# EAGLE schematic s3-pilot2 (EAGLE 7.2.0)
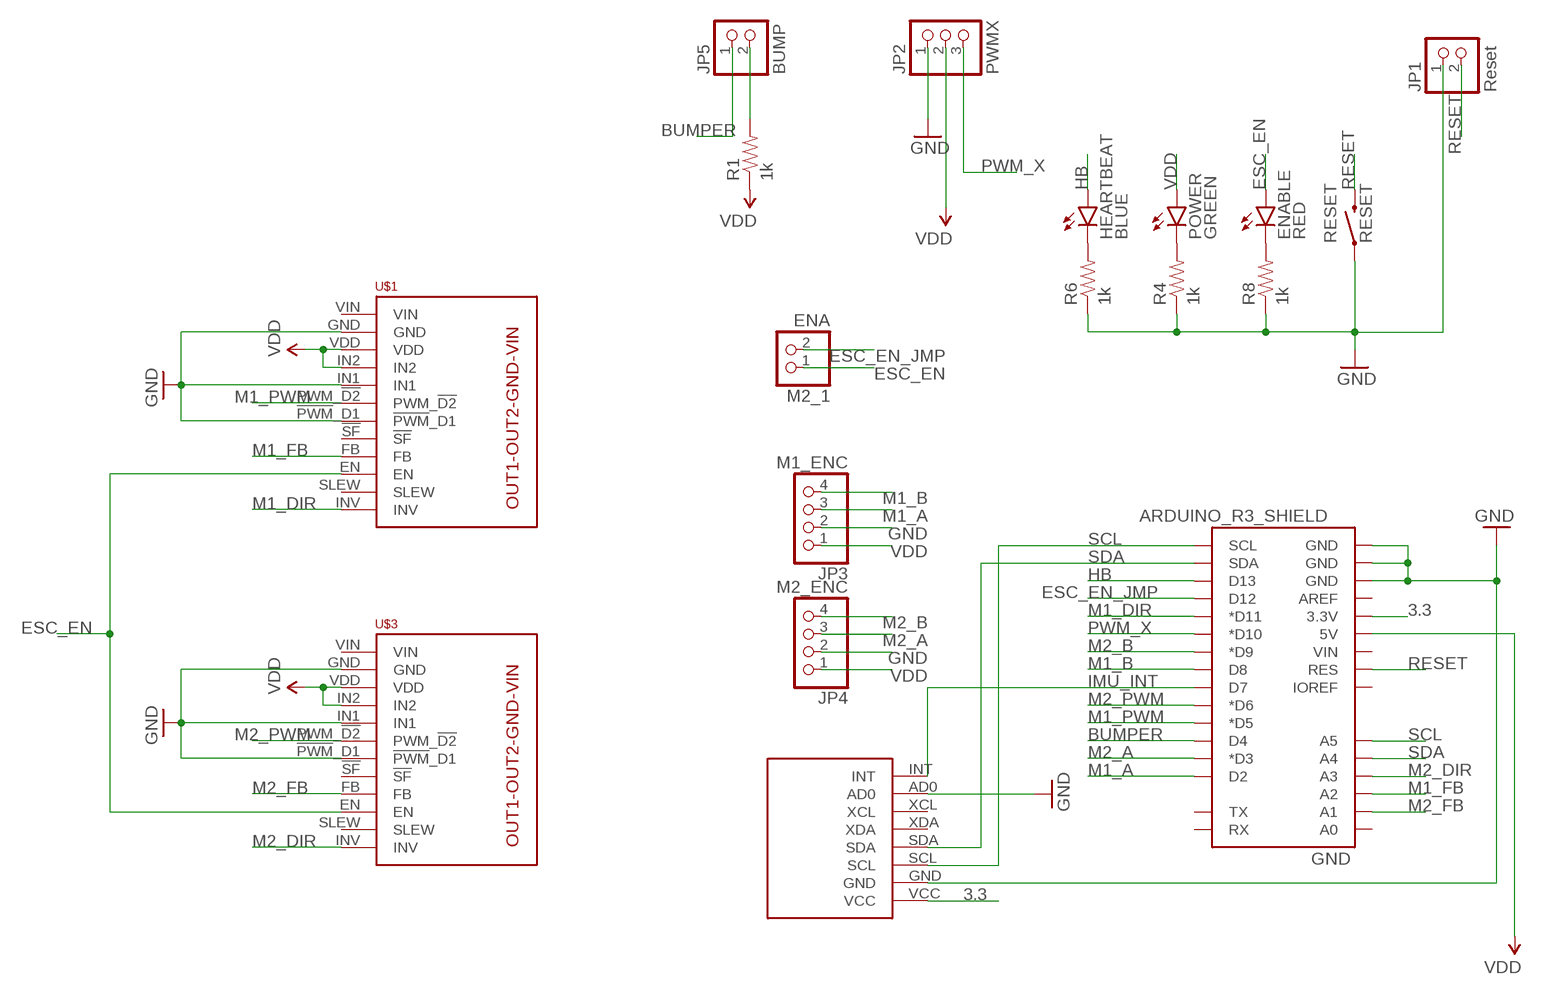
[diagram p0: schematic, sheet 1]

## Parts
ENABLE  RED  LED-RED1206  [LED-1206]
GND  ARDUINO_R3_SHIELD  [UNO_R3_SHIELD]
HEARTBEAT  BLUE  LED-BLUE1206  [LED-1206]
JP1  Reset  PINHD-1X2  [1X02]
JP2  PWMX  PINHD-1X3/90  [1X03/90]
JP3  M1_ENC  PINHD-1X4/90  [1X04/90]
JP4  M2_ENC  PINHD-1X4/90  [1X04/90]
JP5  BUMP  PINHD-1X2/90  [1X02/90]
M2_1  ENA  PINHD-1X2  [1X02]
MPU6050  MPU-6050-BO  [MPU-6050-BO]
POWER  GREEN  LED-GREENLARGE  [LED-1206]
R1  1k  RESISTOR1206  [1206]
R4  1k  RESISTOR1206  [1206]
R6  1k  RESISTOR1206  [1206]
R8  1k  RESISTOR1206  [1206]
RESET  RESET  SWITCH-MOMENTARY-2SMD-4  [TACTILE_SWITCH_TALL]
U$1  M1  MC33926-SINGLE-BO  [MC33926-SINGLE-BO]
U$3  M2  MC33926-SINGLE-BO  [MC33926-SINGLE-BO]

## Nets
3.3: GND.3.3V MPU6050.VCC
BUMPER: GND.D4 JP5.1
ESC_EN: ENABLE.A M2_1.1 U$1.EN U$3.EN
ESC_EN_JMP: GND.D12 M2_1.2
GND [Supply]: GND.GND@0(GND) GND.GND@1(GND) GND.GND@2(GND) JP1.1 JP2.1 JP3.2 JP4.2 MPU6050.AD0 MPU6050.GND R4.1 R6.1 R8.1 RESET.A2 U$1.!PWM!_D1 U$1.GND U$1.IN1 U$3.!PWM!_D1 U$3.GND U$3.IN1
HB: GND.D13 HEARTBEAT.A
IMU_INT: GND.D7 MPU6050.INT
M1_A: GND.D2 JP3.3
M1_B: GND.D8 JP3.4
M1_DIR: GND.D11(*D11) U$1.INV
M1_FB: GND.A2 U$1.FB
M1_PWM: GND.D5(*D5) U$1.PWM_!D2
M2_A: GND.D3(*D3) JP4.3
M2_B: GND.D9(*D9) JP4.4
M2_DIR: GND.A3 U$3.INV
M2_FB: GND.A1 U$3.FB
M2_PWM: GND.D6(*D6) U$3.PWM_!D2
N$3: JP5.2 R1.2
N$21: POWER.C R4.2
N$23: ENABLE.C R8.2
N$24: HEARTBEAT.C R6.2
PWM_X: GND.D10(*D10) JP2.3
RESET: GND.RES JP1.2 RESET.B2
SCL: GND.A5 GND.SCL MPU6050.SCL
SDA: GND.A4 GND.SDA MPU6050.SDA
VDD [Supply]: GND.5V JP2.2 JP3.1 JP4.1 POWER.A R1.1 U$1.IN2 U$1.VDD U$3.IN2 U$3.VDD
Unconnected: GND.A0 GND.AREF GND.IOREF GND.RX GND.TX GND.VIN MPU6050.XCL MPU6050.XDA U$1.!SF U$1.SLEW U$1.VIN U$3.!SF U$3.SLEW U$3.VIN

## Library data of the parts
ENABLE = SparkFun-LED:LED-RED: Assorted Red LEDs LilyPad 1206- DIO-09912 1206- DIO-00809 0603- DIO-00819; PROD_ID: DIO-00809
GND = SparkFun-Boards:ARDUINO_R3_SHIELD: Shield form compatible with the Arduino Uno R3.
HEARTBEAT = SparkFun-LED:LED-BLUE: Blue LEDs for production use Various blue LEDs stocked by SparkFun production 0603 - DIO-08575 Rebel - DIO-09553 1206 - DIO-09911; PROD_ID: DIO-09911
JP1 JP5 M2_1 = pinhead:PINHD-1X2: PIN HEADER
JP2 = pinhead:PINHD-1X3: PIN HEADER
JP3 JP4 = pinhead:PINHD-1X4: PIN HEADER
MPU6050 = s3-pilot2-lbr:MPU-6050-BO
POWER = SparkFun-LED:LED-GREEN: Various green LEDs Green LEDs used in SFE Production 0603- DIO-00821 LARGE- DIO-00862 LILYPAD- DIO-09910; PROD_ID: DIO-00862
R1 R4 R6 R8 = SparkFun-Passives:RESISTOR: Resistor Basic schematic elements and footprints for 0603, 1206, and PTH resistors.
RESET = SparkFun-Electromechanical:SWITCH-MOMENTARY-2: Various NO switches- pushbuttons, reed, etc; PROD_ID: SWCH-11966
U$1 U$3 = s3-pilot2-lbr:MC33926-SINGLE-BO

## Net classes
1 Supply: width 0.508 mm